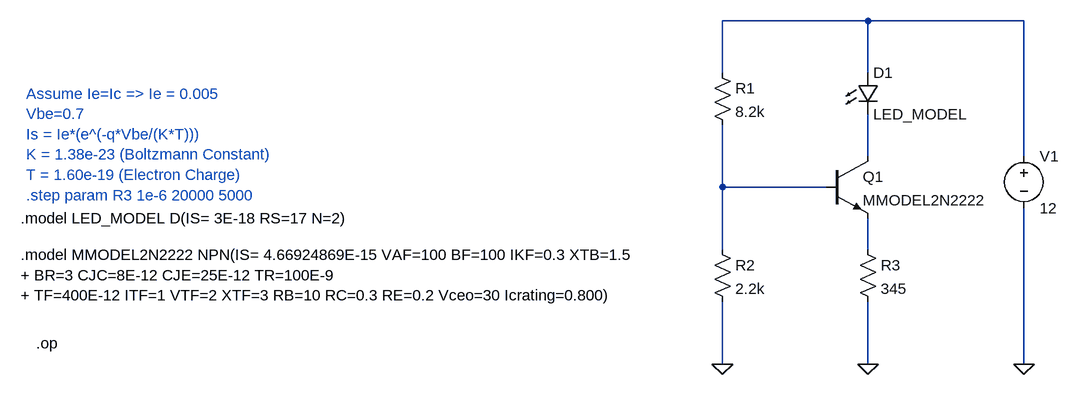
[diagram p0: schematic Transistor_Resistor.asc]
Transistor_Resistor.asc, the LTspice schematic file:
Version 4
SHEET 1 880 680
WIRE 448 -48 224 -48
WIRE 688 -48 448 -48
WIRE 224 32 224 -48
WIRE 448 32 448 -48
WIRE 448 160 448 96
WIRE 688 160 688 -48
WIRE 224 208 224 112
WIRE 384 208 224 208
WIRE 224 304 224 208
WIRE 448 304 448 256
WIRE 224 480 224 384
WIRE 448 480 448 384
WIRE 688 480 688 240
FLAG 688 480 0
FLAG 448 480 0
FLAG 224 480 0
SYMBOL res 208 16 R0
SYMATTR InstName R1
SYMATTR Value 8.2k
SYMBOL res 208 288 R0
SYMATTR InstName R2
SYMATTR Value 2.2k
SYMBOL npn 384 160 R0
SYMATTR InstName Q1
SYMATTR Value MMODEL2N2222
SYMBOL LED 432 32 R0
SYMATTR InstName D1
SYMATTR Value LED_MODEL
SYMATTR Description Diode
SYMATTR Type diode
SYMBOL res 432 288 R0
SYMATTR InstName R3
SYMATTR Value 345
SYMBOL voltage 688 144 R0
WINDOW 123 0 0 Left 0
WINDOW 39 0 0 Left 0
SYMATTR InstName V1
SYMATTR Value 12
TEXT -856 256 Left 2 !.model LED_MODEL D(IS= 3E-18 RS=17 N=2)
TEXT -856 312 Left 2 !.model MMODEL2N2222 NPN(IS= 4.66924869E-15 VAF=100 BF=100 IKF=0.3 XTB=1.5\n+ BR=3 CJC=8E-12 CJE=25E-12 TR=100E-9\n+ TF=400E-12 ITF=1 VTF=2 XTF=3 RB=10 RC=0.3 RE=0.2 Vceo=30 Icrating=0.800)
TEXT -848 64 Left 2 ;Assume Ie=Ic => Ie = 0.005\nVbe=0.7\nIs = Ie*(e^(-q*Vbe/(K*T)))\nK = 1.38e-23 (Boltzmann Constant)\nT = 1.60e-19 (Electron Charge)\n.step param R3 1e-6 20000 5000
TEXT -832 448 Left 2 !.op

The netlist it stands for:
* Transistor_Resistor.asc
R1 N001 N003 8.2k
R2 N003 0 2.2k
Q1 N002 N003 N004 0 MMODEL2N2222
D1 N001 N002 LED_MODEL
R3 N004 0 345
V1 N001 0 12
.model D D
.lib standard.dio
.model NPN NPN
.model PNP PNP
.lib standard.bjt
.model LED_MODEL D(IS= 3E-18 RS=17 N=2)
.model MMODEL2N2222 NPN(IS= 4.66924869E-15 VAF=100 BF=100 IKF=0.3 XTB=1.5
+ BR=3 CJC=8E-12 CJE=25E-12 TR=100E-9
+ TF=400E-12 ITF=1 VTF=2 XTF=3 RB=10 RC=0.3 RE=0.2 Vceo=30 Icrating=0.800)
* Assume Ie=Ic => Ie = 0.005
* Vbe=0.7
* Is = Ie*(e^(-q*Vbe/(K*T)))
* K = 1.38e-23 (Boltzmann Constant)
* T = 1.60e-19 (Electron Charge)
* .step param R3 1e-6 20000 5000
.op
.backanno
.end